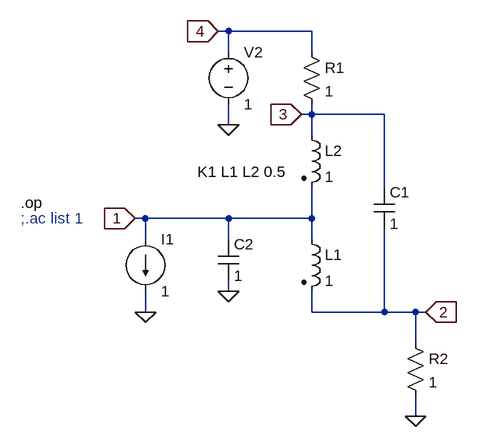
[diagram p0: schematic T-Coil-ver4.asc]
T-Coil-ver4.asc, the LTspice schematic file:
Version 4
SHEET 1 880 680
WIRE 48 -240 32 -240
WIRE 176 -240 48 -240
WIRE 48 -208 48 -240
WIRE 176 -208 176 -240
WIRE 176 -112 176 -128
WIRE 176 -112 160 -112
WIRE 288 -112 176 -112
WIRE 48 -96 48 -128
WIRE 176 -80 176 -112
WIRE 288 0 288 -112
WIRE -80 48 -96 48
WIRE 48 48 -80 48
WIRE 176 48 176 0
WIRE 176 48 48 48
WIRE -80 80 -80 48
WIRE 48 80 48 48
WIRE 176 80 176 48
WIRE 48 160 48 144
WIRE -80 192 -80 160
WIRE 176 192 176 160
WIRE 288 192 288 64
WIRE 288 192 176 192
WIRE 336 192 288 192
WIRE 352 192 336 192
WIRE 336 240 336 192
WIRE 336 352 336 320
FLAG -80 192 0
FLAG 336 352 0
FLAG 48 -96 0
FLAG -96 48 1
IOPIN -96 48 In
FLAG 352 192 2
IOPIN 352 192 In
FLAG 160 -112 3
IOPIN 160 -112 In
FLAG 32 -240 4
IOPIN 32 -240 In
FLAG 48 160 0
SYMBOL ind2 160 64 R0
SYMATTR InstName L1
SYMATTR Value 1
SYMATTR Type ind
SYMATTR SpiceLine Rser=0
SYMBOL ind2 160 -96 R0
SYMATTR InstName L2
SYMATTR Value 1
SYMATTR Type ind
SYMATTR SpiceLine Rser=0
SYMBOL res 160 -224 R0
SYMATTR InstName R1
SYMATTR Value 1
SYMBOL cap 272 0 R0
SYMATTR InstName C1
SYMATTR Value 1
SYMBOL voltage 48 -224 R0
SYMATTR InstName V2
SYMATTR Value 1
SYMBOL current -80 80 R0
SYMATTR InstName I1
SYMATTR Value 1
SYMBOL res 320 224 R0
SYMATTR InstName R2
SYMATTR Value 1
SYMBOL cap 32 80 R0
SYMATTR InstName C2
SYMATTR Value 1
TEXT -272 24 Left 2 !.op
TEXT 0 -24 Left 2 !K1 L1 L2 0.5
TEXT -272 48 Left 2 ;;.ac list 1

The netlist it stands for:
* T-Coil-ver4.asc
L1 1 2 1 Rser=0
L2 3 1 1 Rser=0
R1 4 3 1
C1 3 2 1
V2 4 0 1
I1 1 0 1
R2 2 0 1
C2 1 0 1
.op
K1 L1 L2 0.5
* ;.ac list 1
.backanno
.end